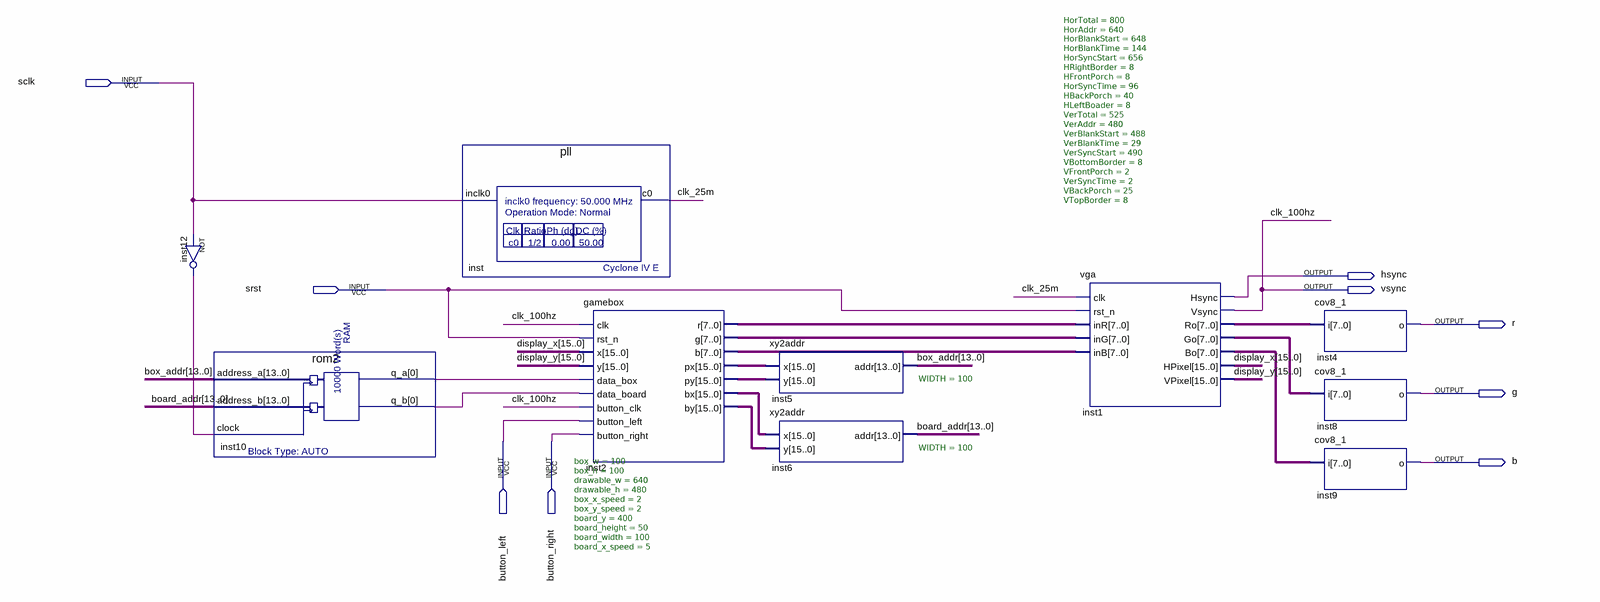
[diagram p0: schematic sheet]
// Quartus schematic gameplay.bdf as structural Verilog: 10 symbols, 9 pins
module gameplay (
  input  sclk,
  input  srst,
  input  button_left,
  input  button_right,
  output hsync,
  output vsync,
  output r,
  output g,
  output b
);

  wire clk_25m, inst10_q_a, inst10_q_b, inst12_out;
  wire [7:0] inst1_bo, inst1_go, inst1_ro, inst2_b, inst2_g, inst2_r;
  wire [13:0] board_addr, box_addr;
  wire [15:0] display_x, display_y, inst2_bx, inst2_by, inst2_px, inst2_py;

  not inst12 (inst12_out, sclk);
  rom2 inst10 (.address_a(box_addr), .address_b(board_addr), .clock(inst12_out), .q_a(inst10_q_a), .q_b(inst10_q_b));
  pll inst (.inclk0(sclk), .c0(clk_25m));
  gamebox #(.box_w(100), .box_h(100), .drawable_w(640), .drawable_h(480), .box_x_speed(2), .box_y_speed(2), .board_y(400), .board_height(50), .board_width(100), .board_x_speed(5)) inst2 (
    .clk(vsync), .rst_n(srst), .x(display_x), .y(display_y), .data_box(inst10_q_a), .data_board(inst10_q_b),
    .button_clk(vsync), .button_left(button_left), .button_right(button_right), .r(inst2_r), .g(inst2_g),
    .b(inst2_b), .px(inst2_px), .py(inst2_py), .bx(inst2_bx), .by(inst2_by));
  xy2addr #(.WIDTH(100)) inst5 (.x(inst2_px), .y(inst2_py), .addr(box_addr));
  xy2addr #(.WIDTH(100)) inst6 (.x(inst2_bx), .y(inst2_by), .addr(board_addr));
  vga #(.HorTotal(800), .HorAddr(640), .HorBlankStart(648), .HorBlankTime(144), .HorSyncStart(656), .HRightBorder(8), .HFrontPorch(8), .HorSyncTime(96), .HBackPorch(40), .HLeftBoader(8), .VerTotal(525), .VerAddr(480), .VerBlankStart(488), .VerBlankTime(29), .VerSyncStart(490), .VBottomBorder(8), .VFrontPorch(2), .VerSyncTime(2), .VBackPorch(25), .VTopBorder(8)) inst1 (
    .clk(clk_25m), .rst_n(srst), .inR(inst2_r), .inG(inst2_g), .inB(inst2_b), .Hsync(hsync), .Vsync(vsync),
    .Ro(inst1_ro), .Go(inst1_go), .Bo(inst1_bo), .HPixel(display_x), .VPixel(display_y));
  cov8_1 inst4 (.i(inst1_ro), .o(r));
  cov8_1 inst8 (.i(inst1_go), .o(g));
  cov8_1 inst9 (.i(inst1_bo), .o(b));

  // Other names for the same wires on the sheet: clk_100hz = vsync
endmodule
